# Altium schematic sheet 03_Heater_Control.SchDoc
size A4; Author: Sasa Karanovic; Organization: Altium Limited; sk_Title: Heater Control; DocumentNumber: 1; SheetNumber: 3; SheetTotal: 5
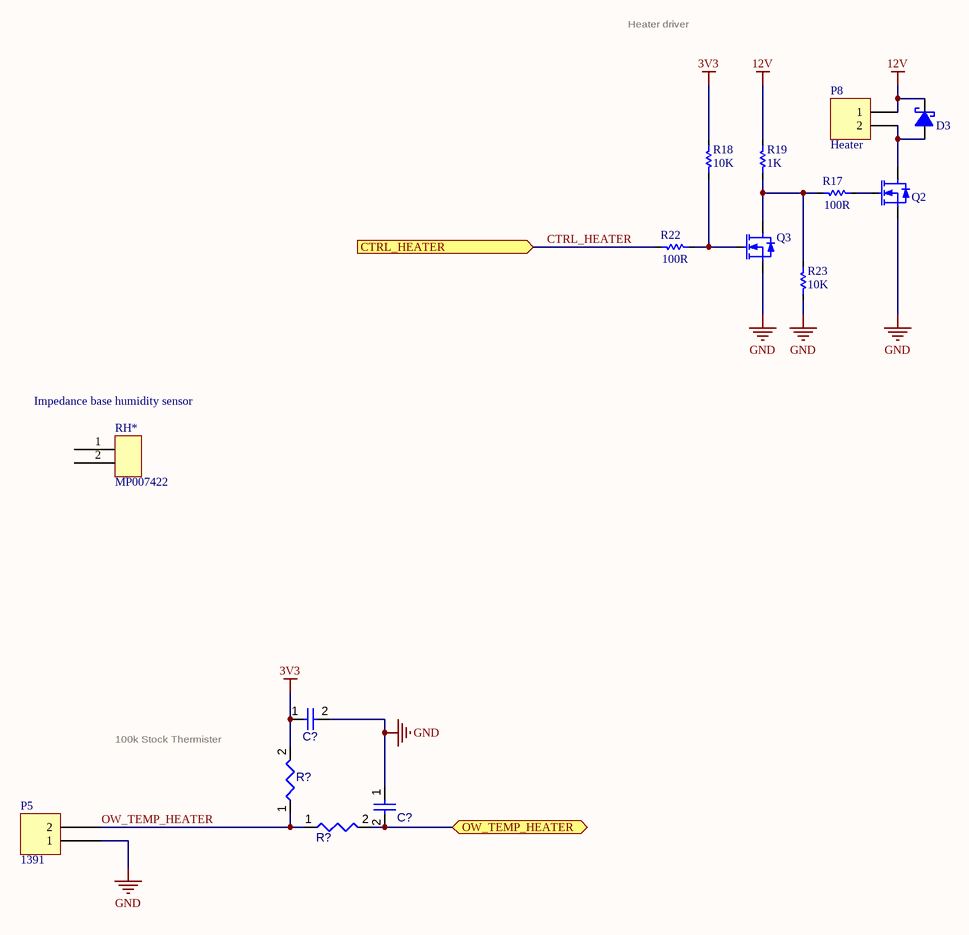
[diagram p0: 03_Heater_Control.SchDoc]

## Parts
(Parts that share a designator on the sheet are numbered #1, #2 ... from top to bottom, then left to right.)
C?#1  Capacitors  (value not drawn)
C?#2  Capacitors  (value not drawn)
D3  Diode Schotky  [SOD123F]  (value not drawn)
P5  1391  [PCB - CONNECTOR - HEADER - MALE 1X2]
P8  Heater  [Header 2x1]
Q2  PSMN9R1-30YL  [LFPAK-8]  (value not drawn)
Q3  DMN62D0U-13  [SOT90P240X100-3N]  (value not drawn)
R17  value 100R  [0603 - HS]  (hidden comment: Res)
R18  value 10K  [0603 - HS]  (hidden comment: Res)
R19  value 1K  [0603 - HS]  (hidden comment: Res)
R22  value 100R  [0603 - HS]  (hidden comment: Res)
R23  value 10K  [0603 - HS]  (hidden comment: Res)
R?#1  Resistors  (value not drawn)
R?#2  Resistors  (value not drawn)
RH*  MP007422  [MP007422_V]

## Ports
CTRL_HEATER (in), OW_TEMP_HEATER (bidir)

## Nets
3V3: C?#1.1 R18.1 R?#1.2
12V: D3.K P8.1 R19.1
GND: C?#1.2 C?#2.1 P5.1 Q2.S Q3.2(S) R23.2
CTRL_HEATER: R22.1 ; port CTRL_HEATER
OW_TEMP_HEATER: P5.2 R?#1.1 R?#2.1
OW_TEMP_HEATER: C?#2.2 R?#2.2 ; port OW_TEMP_HEATER  [a separate net that carries the same name]
NetD3_A: D3.A P8.2 Q2.D
NetQ2_G: Q2.G R17.2
NetQ3_1: Q3.1(G) R18.2 R22.2
NetQ3_3: Q3.3(D) R17.1 R19.2 R23.1

Not connected (* = marked no-connect by the designer): RH* 1 2

## Notes on the sheet
- Heater driver
- (near RH*) Impedance base humidity sensor
- 100k Stock Thermister
- Page
- Title
- www.SasaKaranovic.com <http://www.SasaKaranovic.com>
- of

## Library data of the parts
C?#1 C?#2 = Capacitors: Capacitor; Component Type: Capacitors
D3 = Diode Schotky: Manufacturer: Nexperia USA Inc.; Manufacturer Part Number: PMEG6010CEH,115; Distributor: DigiKey; Distributor Part Number: 1727-3848-1-ND
P5 = CMP-002-00087-1: Connector Header Through Hole 2 position 0.100&quot; (2.54mm); Manufacturer part number: PRPC002SAAN-RC; Manufacturer: Sullins Connector Solutions; Mounting Angle: Straight; Connector Type: Header, Breakaway; Current Rating: 3.0 A; Male or Female: Male; Number of Positions: 2; Rowan Part Number: 1391; Category: Headers; Status: Active; Number of Rows: 1; Material: Gold; Datasheet: https://media.digikey.com/PDF/Data%20Sheets/Sullins%20PDFs/xRxCzzzSxxN-RC_ST_11635-B.pdf
P8 = Header 2: Header, 2-Pin
Q2 = PSMN9R1-30YL: MOSFET N-CH 30V 37A LFPAK; Manufacturer: Nexperia USA Inc.; Manufacturer Part Number: PSMN011-30YLC,115; Distributor: DigiKey
Q3 = DMN62D0U-13: MOSFET N-CH 60V 0.38A; Manufacturer: Diodes Incorporated; Manufacturer Part Number: DMN62D0U-13; Distributor: DigiKey; Distributor Part Number: DMN62D0U-13DICT-ND
R17 R22 = Res: Resistor; Manufacturer: Stackpole Electronics Inc; Manufacturer Part Number: RMCF0603FT100R; Distributor: DigiKey; Distributor Part Number: RMCF0603FT100RCT-ND
R18 R23 = Res: Resistor; Manufacturer: Stackpole Electronics Inc; Manufacturer Part Number: RMCF0603JT10K0; Distributor: DigiKey; Distributor Part Number: RMCF0603JT10K0CT-ND
R19 = Res: Resistor; Manufacturer: Stackpole Electronics Inc; Manufacturer Part Number: RNCS0603BKE1K00; Distributor: DigiKey; Distributor Part Number: RNCS0603BKE1K00CT-ND
R?#1 R?#2 = Resistors: Resistor; Component Type: Resistors